# Altium schematic sheet Camera.SchDoc
size A4; DocumentNumber: 7; SheetNumber: 7; SheetTotal: 8
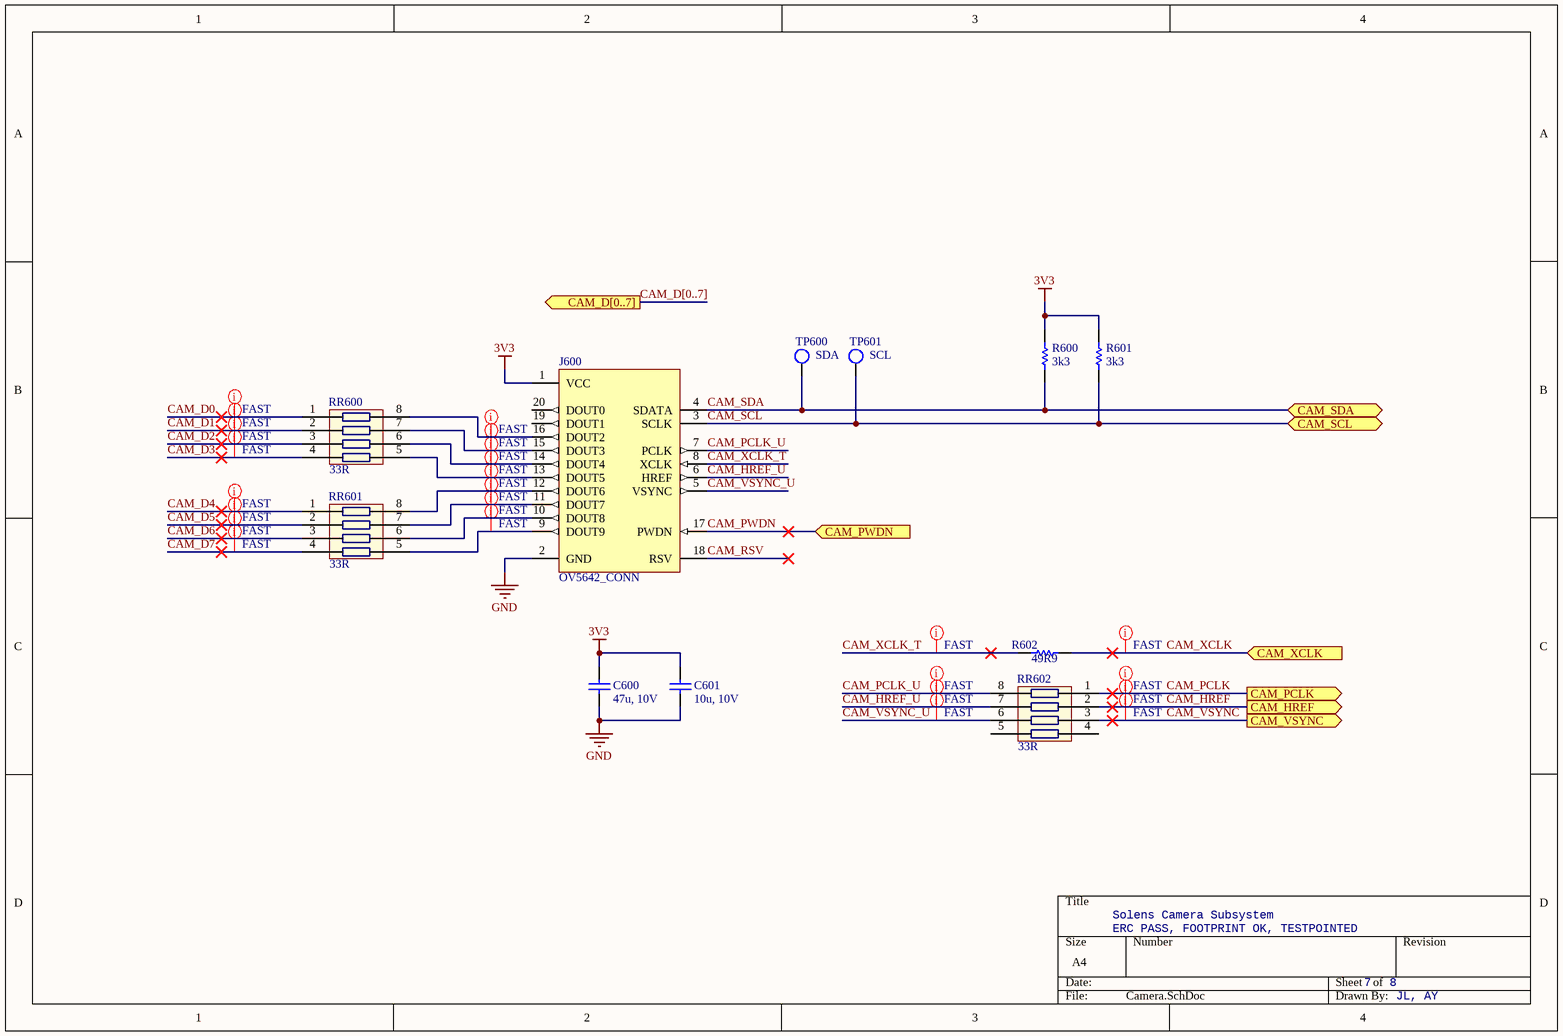
[diagram p0: Camera.SchDoc]

## Parts
C600  value 47u, 10V  [CAP_1206]  (hidden comment: 47u, 10V, 1206)
C601  value 10u, 10V  [CAP_1206]  (hidden comment: 10u, 10V, 1206)
J600  Function: OV5642_CONN  [OV5642_HDR_2x10]  (hidden comment: SOK_2x10_100TH_THT)
R600  value 3k3  [RES_0805]  (hidden comment: 3k3, 1/8W, 0805)
R601  value 3k3  [RES_0805]  (hidden comment: 3k3, 1/8W, 0805)
R602  value 49R9  [RES_0805]  (hidden comment: 49R9, 1/8W, 0805)
RR600  value 33R  [CAC-80P319X150-8M]  (hidden comment: CRA6S833CT-ND)
RR601  value 33R  [CAC-80P319X150-8M]  (hidden comment: CRA6S833CT-ND)
RR602  value 33R  [CAC-80P319X150-8M]  (hidden comment: CRA6S833CT-ND)
TP600  VisibleNetName: SDA  [TP_SMALL]  (hidden comment: TP (DNP))
TP601  VisibleNetName: SCL  [TP_SMALL]  (hidden comment: TP (DNP))

## Ports
CAM_D[0..7] (out), CAM_HREF (out), CAM_PCLK (out), CAM_PWDN (in), CAM_SCL (bidir), CAM_SDA (bidir), CAM_VSYNC (out), CAM_XCLK (in)

## Nets
3V3: C600.1 C601.1 J600.1(VCC) R600.1 R601.1
GND: C600.2 C601.2 J600.2(GND)
CAM_D0: RR600.1(1A)
CAM_D1: RR600.2(2A)
CAM_D2: RR600.3(3A)
CAM_D3: RR600.4(4A)
CAM_D4: RR601.1(1A)
CAM_D5: RR601.2(2A)
CAM_D6: RR601.3(3A)
CAM_D7: RR601.4(4A)
CAM_HREF: RR602.2(2A) ; port CAM_HREF
CAM_HREF_U: J600.6(HREF) RR602.7(2B)
CAM_PCLK: RR602.1(1A) ; port CAM_PCLK
CAM_PCLK_U: J600.7(PCLK) RR602.8(1B)
CAM_PWDN: J600.17(PWDN) ; port CAM_PWDN
CAM_RSV: J600.18(RSV)
CAM_SCL: J600.3(SCLK) R601.2 TP601.1 ; port CAM_SCL
CAM_SDA: J600.4(SDATA) R600.2 TP600.1 ; port CAM_SDA
CAM_VSYNC: RR602.3(3A) ; port CAM_VSYNC
CAM_VSYNC_U: J600.5(VSYNC) RR602.6(3B)
CAM_XCLK: R602.2 ; port CAM_XCLK
CAM_XCLK_T: J600.8(XCLK) R602.1
NetJ600_9: J600.9(DOUT9) RR601.5(4B)
NetJ600_10: J600.10(DOUT8) RR601.6(3B)
NetJ600_11: J600.11(DOUT7) RR601.7(2B)
NetJ600_12: J600.12(DOUT6) RR601.8(1B)
NetJ600_13: J600.13(DOUT5) RR600.5(4B)
NetJ600_14: J600.14(DOUT4) RR600.6(3B)
NetJ600_15: J600.15(DOUT3) RR600.7(2B)
NetJ600_16: J600.16(DOUT2) RR600.8(1B)

Not connected (* = marked no-connect by the designer): J600 19(DOUT1) 20(DOUT0); RR602 4(4A) 5(4B)

## Buses and harness runs
bus CAM_D[0..7] = port CAM_D[0..7]

## Layout directives
net class FAST: CAM_D0, CAM_D1, CAM_D2, CAM_D3, CAM_D4, CAM_D5, CAM_D6, CAM_D7, CAM_HREF, CAM_HREF_U, CAM_PCLK, CAM_PCLK_U, CAM_VSYNC, CAM_VSYNC_U, CAM_XCLK, CAM_XCLK_T, NetJ600_9, NetJ600_10, NetJ600_11, NetJ600_12, NetJ600_13, NetJ600_14, NetJ600_15, NetJ600_16

## Notes on the sheet
- Solens Camera Subsystem
- ERC PASS, FOOTPRINT OK, TESTPOINTED
- JL, AY

## Library data of the parts
C600 C601 = Cap: Capacitor
  C600: DigikeyPN: 1276-3063-1-ND
  C601: DigikeyPN: 1276-1312-1-ND
J600 = CAMERA_2x10: 20-pin parallel camera connector for OV5642; DigikeyPN: S6106-ND; Value: SOK_2x10_100TH_THT
R600-R602 = Res1: Resistor
  R600 R601: DigikeyPN: 311-3.30KCRCT-ND
  R602: DigikeyPN: 311-49.9CRCT-ND
RR600-RR602 = RES_ARR_4: 4 element resistor array; DigikeyPN: CRA6S833CT-ND
TP600 TP601 = TP_SMALL: Value: TP_SMALL (DNP); DigikeyPN: 36-5015CT-ND; DNP: DNP